# Altium schematic sheet 03_Power.SchDoc
size A3; SheetNumber: 3; SheetTotal: 5
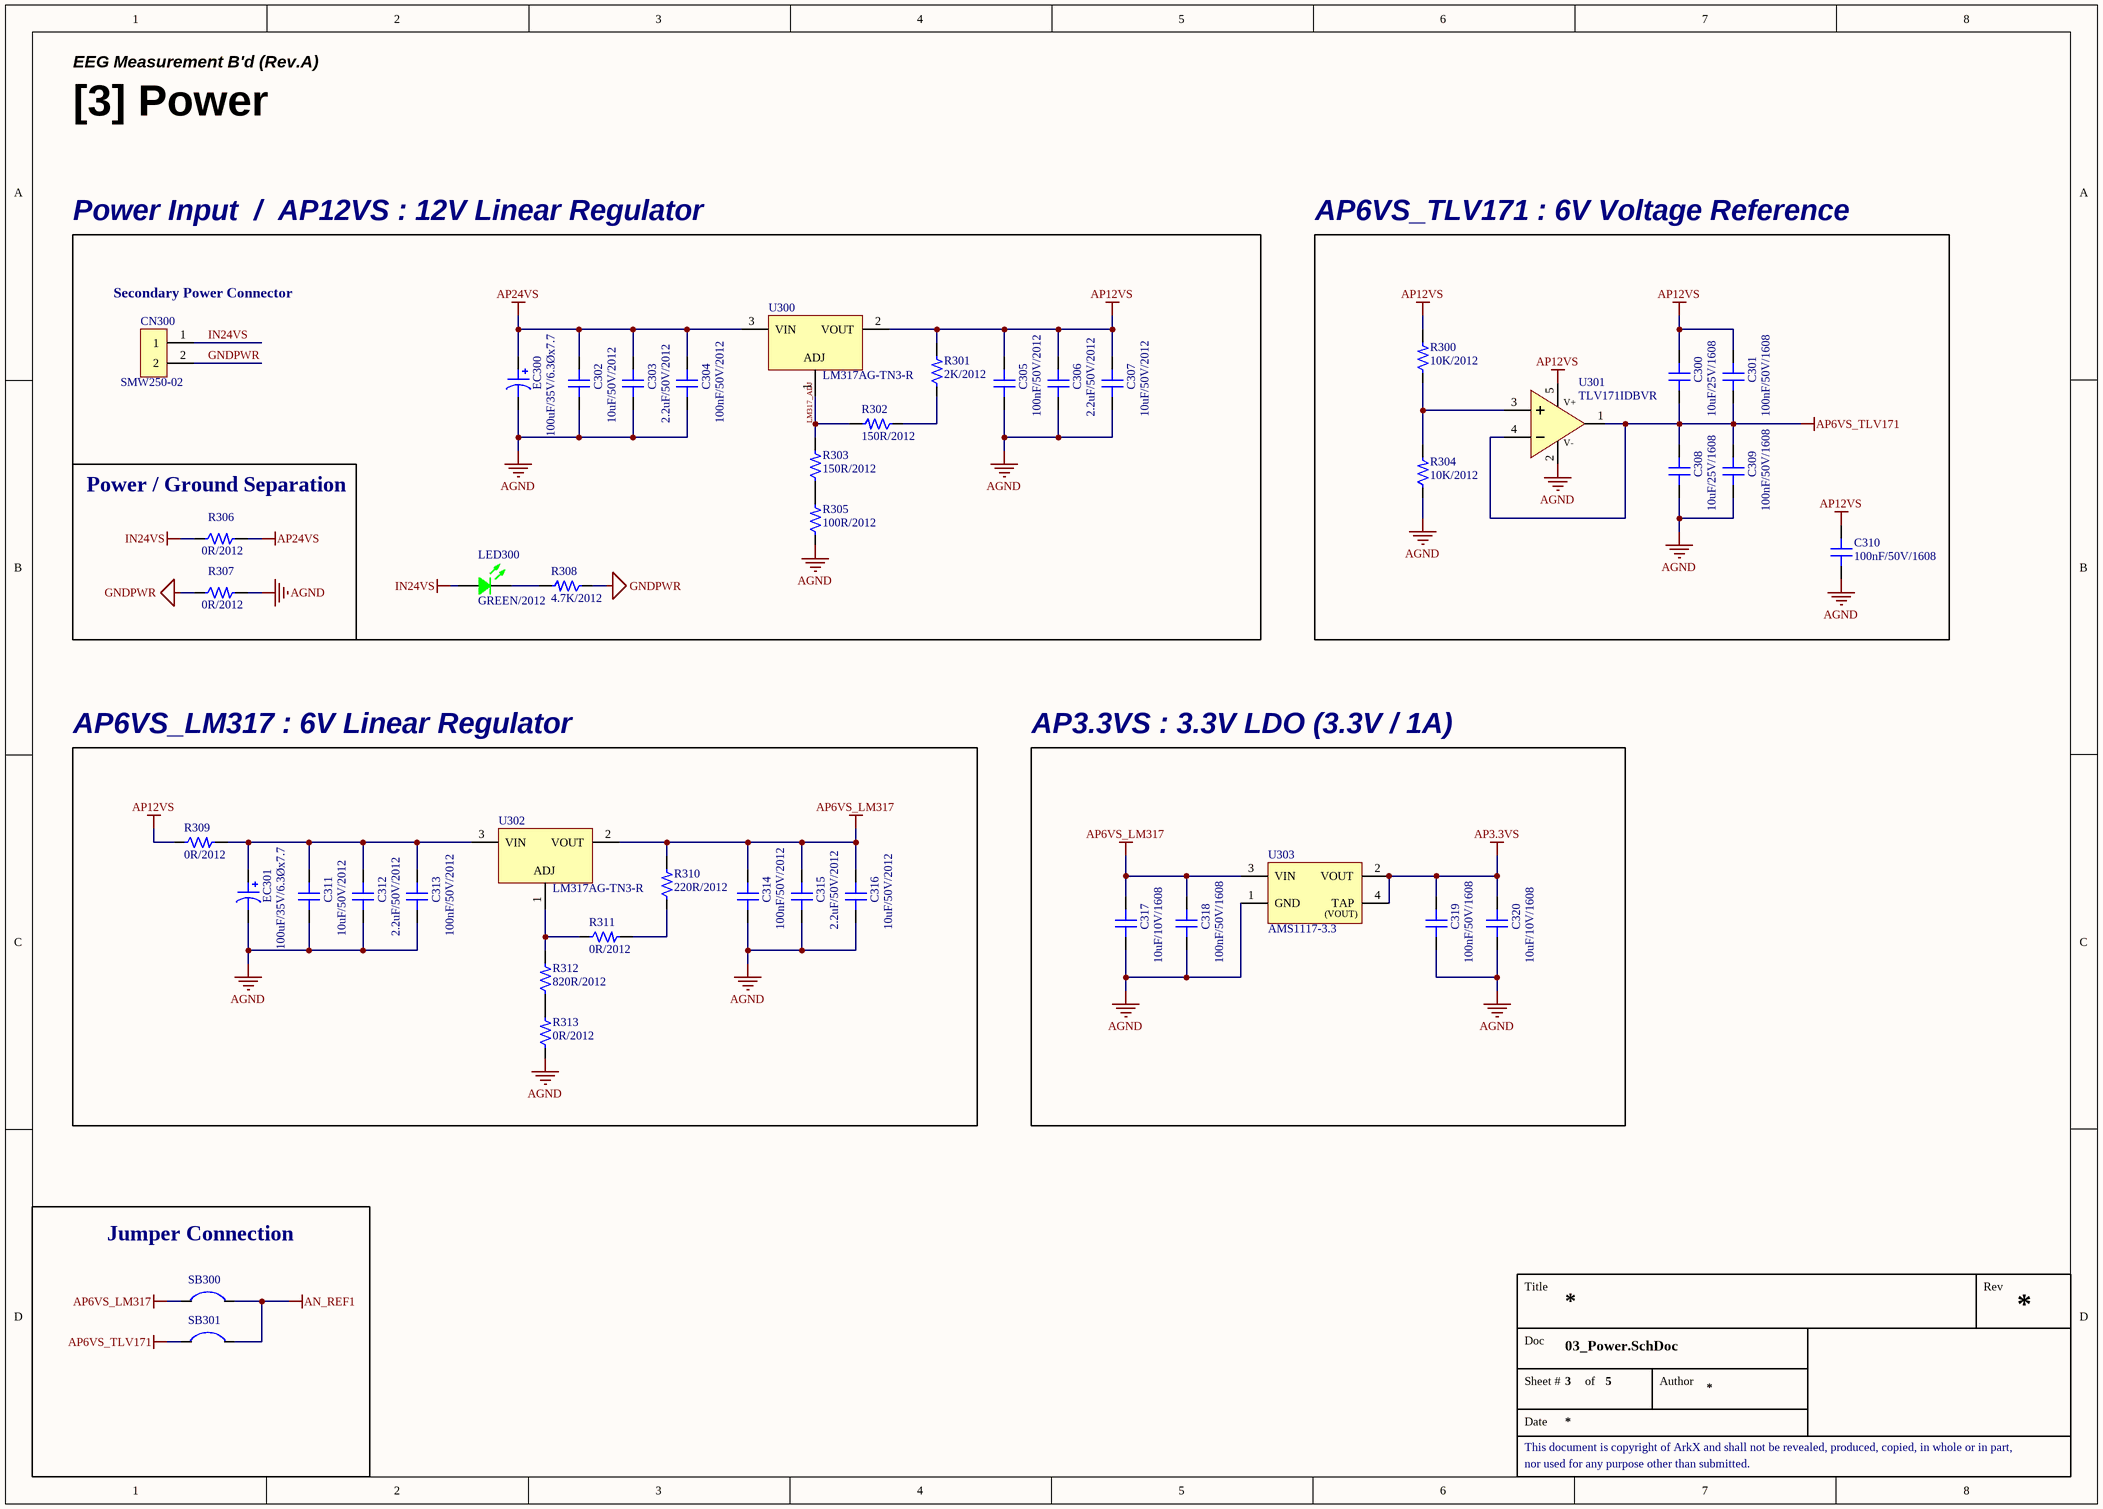
[diagram p0: 03_Power.SchDoc]

## Parts
C300  10uF/25V/1608  [CAP 1608 (0603_INCH)]
C301  100nF/50V/1608  [CAP 1608 (0603_INCH)]
C302  10uF/50V/2012  [CAP 2012 (0805_INCH)]
C303  2.2uF/50V/2012  [CAP 2012 (0805_INCH)]
C304  100nF/50V/2012  [CAP 2012 (0805_INCH)]
C305  100nF/50V/2012  [CAP 2012 (0805_INCH)]
C306  2.2uF/50V/2012  [CAP 2012 (0805_INCH)]
C307  10uF/50V/2012  [CAP 2012 (0805_INCH)]
C308  10uF/25V/1608  [CAP 1608 (0603_INCH)]
C309  100nF/50V/1608  [CAP 1608 (0603_INCH)]
C310  100nF/50V/1608  [CAP 1608 (0603_INCH)]
C311  10uF/50V/2012  [CAP 2012 (0805_INCH)]
C312  2.2uF/50V/2012  [CAP 2012 (0805_INCH)]
C313  100nF/50V/2012  [CAP 2012 (0805_INCH)]
C314  100nF/50V/2012  [CAP 2012 (0805_INCH)]
C315  2.2uF/50V/2012  [CAP 2012 (0805_INCH)]
C316  10uF/50V/2012  [CAP 2012 (0805_INCH)]
C317  10uF/10V/1608  [CAP 1608 (0603_INCH)]
C318  100nF/50V/1608  [CAP 1608 (0603_INCH)]
C319  100nF/50V/1608  [CAP 1608 (0603_INCH)]
C320  10uF/10V/1608  [CAP 1608 (0603_INCH)]
CN300  SMW250-02  [CON_SMW250-02]
EC300  100uF/35V/6.3Øx7.7  [CAP ALSMD 6.6MM H7.7MM]
EC301  100uF/35V/6.3Øx7.7  [CAP ALSMD 6.6MM H7.7MM]
LED300  GREEN/2012  [LED MHT170RGBCT (GREEN)]
R300  10K/2012  [RES 2012 (0805_inch)]
R301  2K/2012  [RES 2012 (0805_inch)]
R302  150R/2012  [RES 2012 (0805_inch)]
R303  150R/2012  [RES 2012 (0805_inch)]
R304  10K/2012  [RES 2012 (0805_inch)]
R305  100R/2012  [RES 2012 (0805_inch)]
R306  0R/2012  [RES 2012 (0805_inch)]
R307  0R/2012  [RES 2012 (0805_inch)]
R308  4.7K/2012  [RES 2012 (0805_inch)]
R309  0R/2012  [RES 2012 (0805_inch)]
R310  220R/2012  [RES 2012 (0805_inch)]
R311  0R/2012  [RES 2012 (0805_inch)]
R312  820R/2012  [RES 2012 (0805_inch)]
R313  0R/2012  [RES 2012 (0805_inch)]
SB300  SB  [SB (Solder-Bridge)]  (value not drawn)
SB301  SB  [SB (Solder-Bridge)]  (value not drawn)
U300  LM317AG-TN3-R  [IC_TO-252-2(DPAK)]
U301  TLV171IDBVR  [SOT-23-5 (TI DBV PACKAGE)]
U302  LM317AG-TN3-R  [IC_TO-252-2(DPAK)]
U303  AMS1117-3.3  [SOT 223-3 (DIODES INCORPORATED)]

## Blocks framed on the sheet
Power Input  /  AP12VS : 12V Linear Regulator: C302-C307 CN300 EC300 LED300 R301-R303 R305 R308 U300
AP6VS_TLV171 : 6V Voltage Reference: C300 C301 C308-C310 R300 R304 U301
Power / Ground Separation: R306 R307
AP6VS_LM317 : 6V Linear Regulator: C311-C316 EC301 R309-R313 U302
AP3.3VS : 3.3V LDO (3.3V / 1A): C317-C320 U303
Jumper Connection: SB300 SB301

## Nets
AGND: C302.1 C303.1 C304.1 C305.1 C306.1 C307.1 C308.1 C309.1 C310.1 C311.1 C312.1 C313.1 C314.1 C315.1 C316.1 C317.1 C318.1 C319.1 C320.1 EC300.2 EC301.2 R304.1 R305.1 R307.2 R313.1 U301.2(V-) U303.1(GND)
AN_REF1: SB300.1 SB301.1
AP3.3VS: C319.2 C320.2 U303.2(VOUT) U303.4(TAP)
AP6VS_LM317: C314.2 C315.2 C316.2 C317.2 C318.2 R310.2 SB300.2 U302.2(VOUT) U303.3(VIN)
AP6VS_TLV171: C300.1 C301.1 C308.2 C309.2 SB301.2 U301.1(OUT) U301.4(IN-)
AP12VS: C300.2 C301.2 C305.2 C306.2 C307.2 C310.2 R300.2 R301.2 R309.1 U300.2(VOUT) U301.5(V+)
AP24VS: C302.2 C303.2 C304.2 EC300.1 R306.2 U300.3(VIN)
GNDPWR: CN300.2 R307.1 R308.1
IN24VS: CN300.1 LED300.4(Common_Anode) R306.1
LM317_ADJ: R302.2 R303.2 U300.1(ADJ)
NetC311_2: C311.2 C312.2 C313.2 EC301.1 R309.2 U302.3(VIN)
NetLED300_2: LED300.2(GREEN) R308.2
NetR300_1: R300.1 R304.2 U301.3(IN+)
NetR301_1: R301.1 R302.1
NetR303_1: R303.1 R305.2
NetR310_1: R310.1 R311.2
NetR311_1: R311.1 R312.2 U302.1(ADJ)
NetR312_1: R312.1 R313.2

## Notes on the sheet
- EEG Measurement B'd (Rev.A)
- [3] Power
- (near CN300) Secondary Power Connector
- Title
- Rev
- Doc
- Sheet #
- of
- Author
- This document is copyright of ArkX and shall not be revealed, produced, copied, in whole or in part,
- Date
- nor used for any purpose other than submitted.
- (in symbol IC_REG_AMS1117-3.3) (VOUT)

## Library data of the parts
C300 C308 = CAP_10uF/25V/1608: Ceramic CAP_10uF/25V/1608; LCSC Part #: C96446; JLCPCB Part Type: Basic Part
C301 C309 C310 C318 C319 = CAP_100nF/50V/1608: Ceramic CAP_100nF/50V/1608; LCSC Part #: C14663; JLCPCB Part Type: Basic Part
C302 C307 C311 C316 = CAP_10uF/50V/2012: Ceramic CAP_10uF/50V/2012; LCSC Part #: C440198; JLCPCB Part Type: Basic Part
C303 C306 C312 C315 = CAP_2.2uF/50V/2012: Ceramic CAP_2.2uF/50V/2012; LCSC Part #: C377773; JLCPCB Part Type: Basic Part
C304 C305 C313 C314 = CAP_100nF/50V/2012: Ceramic CAP_100nF/50V/2012; LCSC Part #: C49678; JLCPCB Part Type: Basic Part
C317 C320 = CAP_10uF/10V/1608: Ceramic CAP_10uF/10V/1608; LCSC Part #: C19702; JLCPCB Part Type: Basic Part
CN300 = CON_SMW250-02: YEONHO 2.5mm Pitch Vertical Connector 2Pin
EC300 EC301 = CAP_EC 100uF/35V/6.3Øx7.7: Eletrolytic CAP_100uF/35V/6.3Øx7.7; LCSC Part #: C176666; JLCPCB Part Type: Extended Part
LED300 = LED_MHT170RGBCT(GREEN): Colorless transparence -30℃~+85℃ Positive post Common anode RGB 120° 0805  Light Emitting Diodes (LED) ROHS; LCSC Part #: C2962094; JLCPCB Part Type: Extended Part
R300 R304 = RES_10K/2012/0.125W: Value: 10K; Power Rating: 0.125W; Precision: 1%; Size: 2012; LCSC Part #: C17414; JLCPCB Part Type: Basic Part
R301 = RES_2K/2012/0.125W: Value: 2K; Power Rating: 0.125W; Precision: 1%; Size: 2012; LCSC Part #: C17604; JLCPCB Part Type: Basic Part
R302 R303 = RES_150R/2012/0.125W: Value: 150R; Power Rating: 0.1W; Precision: 1%; Size: 1608; LCSC Part #: C17471; JLCPCB Part Type: Basic Part
R305 = RES_100R/2012/0.125W: Value: 100R; Power Rating: 0.125W; Precision: 1%; Size: 2012; LCSC Part #: C17408; JLCPCB Part Type: Basic Part
R306 R307 R309 R311 R313 = RES_0R/2012/0.125W: Value: 0R; Power Rating: 0.125W; Precision: 1%; Size: 2012; LCSC Part #: C17477; JLCPCB Part Type: Basic Part
R308 = RES_4.7K/2012/0.125W: Value: 4.7K; Power Rating: 0.125W; Precision: 1%; Size: 2012; LCSC Part #: C17673; JLCPCB Part Type: Basic Part
R310 = RES_220R/2012/0.125W: Value: 220R; Power Rating: 0.125W; Precision: 1%; Size: 2012; LCSC Part #: C17557; JLCPCB Part Type: Basic Part
R312 = RES_820R/2012/0.125W: Value: 820R; Power Rating: 0.125W; Precision: 1%; Size: 2012; LCSC Part #: C17837; JLCPCB Part Type: Basic Part
SB300 SB301 = SB_Solder-Bridge
U300 U302 = IC_REG_LM317AG-TN3-R: 1.5A 5V@(500mA) Adjustable 1.2V~37V Positive 1 40V TO-252-2(DPAK)  Linear Voltage Regulators (LDO) ROHS; LCSC Part #: C75510; JLCPCB Part Type: Basic Part
U301 = IC_OPAMP_TLV171IDBVR: Single, 36-V, 3-MHz, low-power operational amplifier for cost-sensitive applications; LCSC Part #: C2864299; JLCPCB Part Type: Extended Part
U303 = IC_REG_AMS1117-3.3: 72dB@(120Hz) 1A 1.3V@(800mA) Fixed 3.3V~3.3V Positive 1 SOT-223  Linear Voltage Regulators (LDO) ROHS; LCSC Part #: C6186; JLCPCB Part Type: Basic Part